# EAGLE schematic BrainA1-5March2015 (EAGLE 7.2.0)
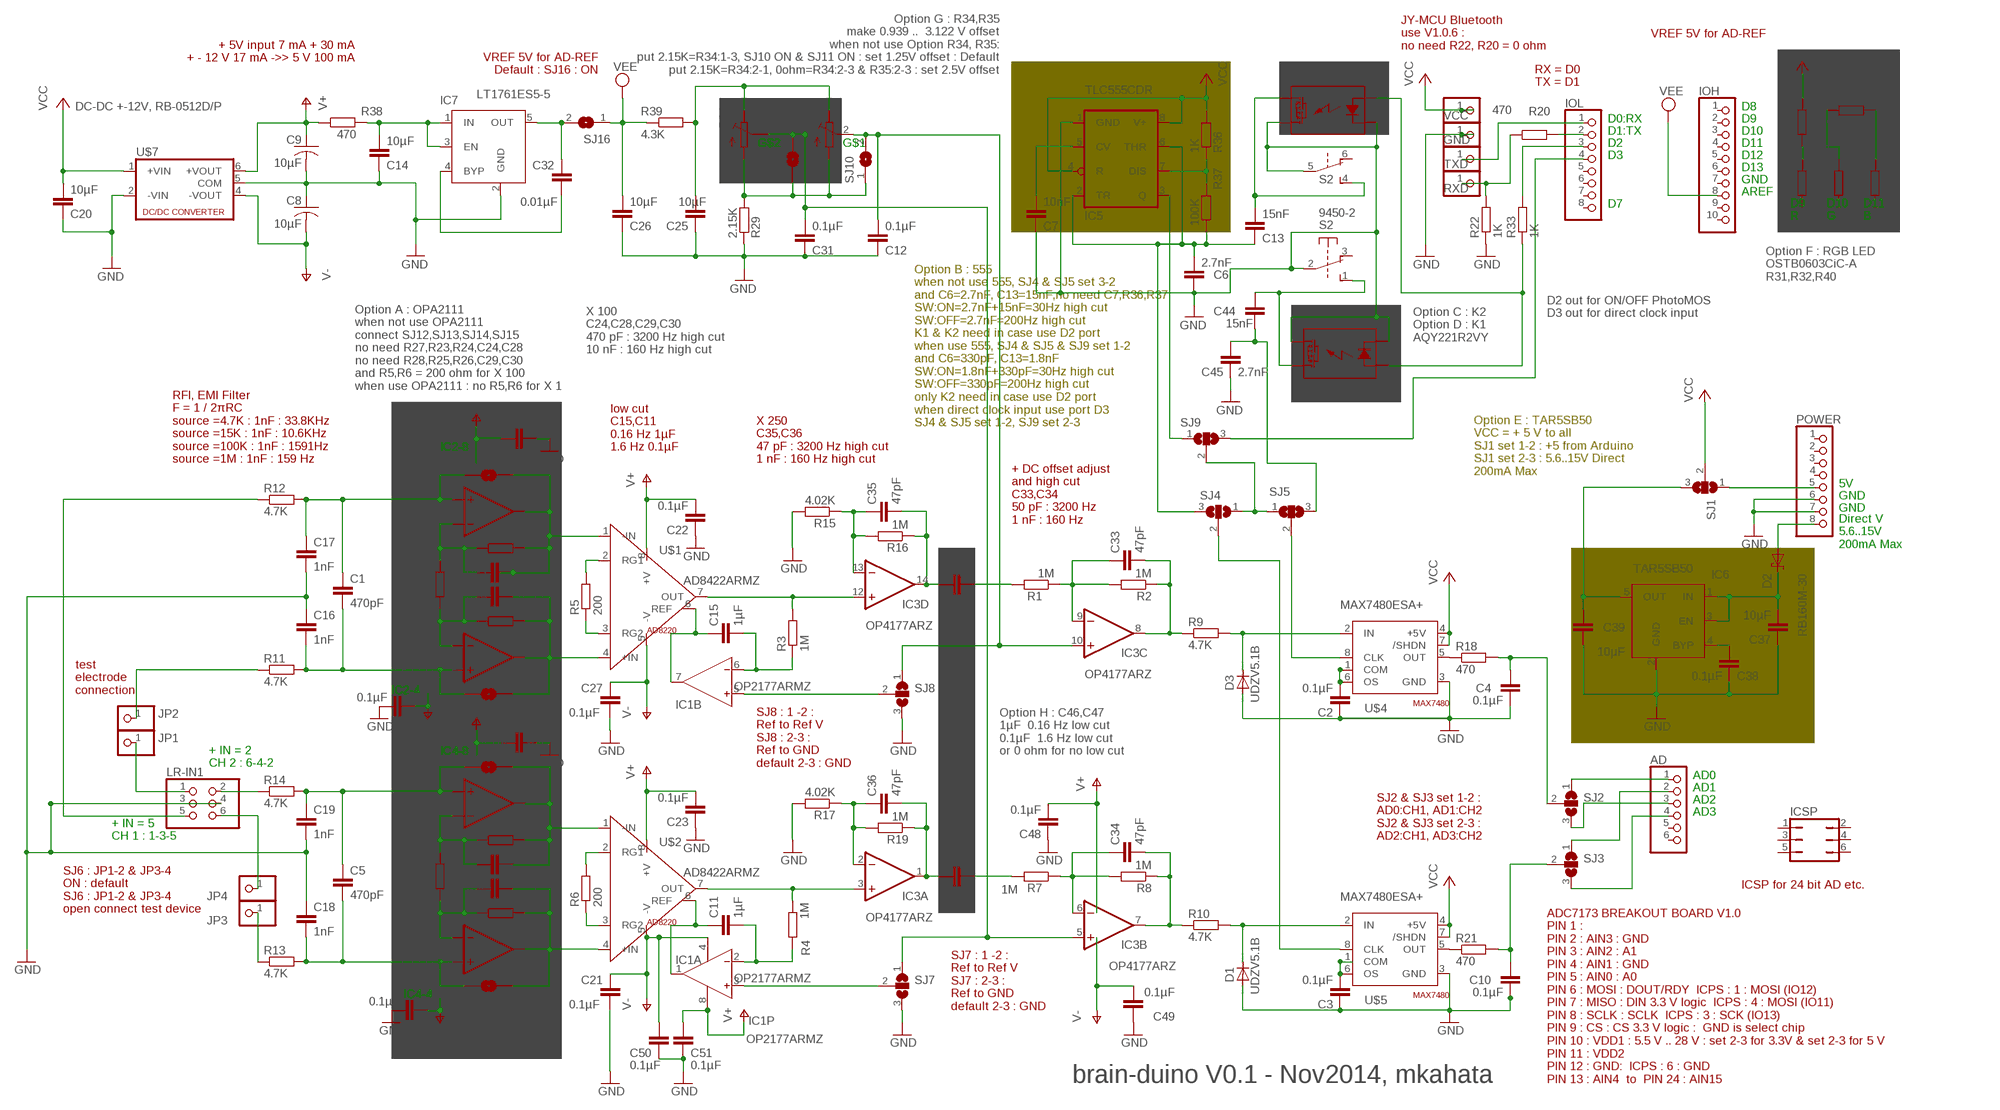
[diagram p0: schematic, sheet 1]

## Parts
AD  PINHD-1X6  [1X06]
C1  470pF  C-EUC0805  [C0805]
C2  0.1µF  C-EUC0805  [C0805]
C3  0.1µF  C-EUC0805  [C0805]
C4  0.1µF  C-EUC0805  [C0805]
C5  470pF  C-EUC0805  [C0805]
C6  2.7nF  C-EUC0805  [C0805]
C7  10nF  C-EUC0805  [C0805]
C8  10µF  C-USC0805  [C0805]
C9  10µF  C-USC0805  [C0805]
C10  0.1µF  C-EUC0805  [C0805]
C11  1µF  C-EUC0805  [C0805]
C12  0.1µF  C-EUC0805  [C0805]
C13  15nF  C-EUC0805  [C0805]
C14  10µF  C-EUC0805  [C0805]
C15  1µF  C-EUC0805  [C0805]
C16  1nF  C-EUC0805  [C0805]
C17  1nF  C-EUC0805  [C0805]
C18  1nF  C-EUC0805  [C0805]
C19  1nF  C-EUC0805  [C0805]
C20  10µF  C-EUC0805  [C0805]
C21  0.1µF  C-EUC0805  [C0805]
C22  0.1µF  C-EUC0805  [C0805]
C23  0.1µF  C-EUC0805  [C0805]
C24  470pF  C-EUC0805  [C0805]
C25  10µF  C-EUC0805  [C0805]
C26  10µF  C-EUC0805  [C0805]
C27  0.1µF  C-EUC0805  [C0805]
C28  470pF  C-EUC0805  [C0805]
C29  470pF  C-EUC0805  [C0805]
C30  470pF  C-EUC0805  [C0805]
C31  0.1µF  C-EUC0805  [C0805]
C32  0.01µF  C-EUC0805  [C0805]
C33  47pF  C-EUC0805  [C0805]
C34  47pF  C-EUC0805  [C0805]
C35  47pF  C-EUC0805  [C0805]
C36  47pF  C-EUC0805  [C0805]
C37  10µF  C-EUC0805  [C0805]
C38  0.1µF  C-EUC0805  [C0805]
C39  10µF  C-EUC0805  [C0805]
C40  0.1µF  C-EUC0805  [C0805]
C41  0.1µF  C-EUC0805  [C0805]
C42  0.1µF  C-EUC0805  [C0805]
C43  0.1µF  C-EUC0805  [C0805]
C44  15nF  C-EUC0805  [C0805]
C45  2.7nF  C-EUC0805  [C0805]
C46  1µF  C-EUC0805  [C0805]
C47  1µF  C-EUC0805  [C0805]
C48  0.1µF  C-EUC0805  [C0805]
C49  0.1µF  C-EUC0805  [C0805]
C50  0.1µF  C-EUC0805  [C0805]
C51  0.1µF  C-EUC0805  [C0805]
D1  UDZV5.1B  DIODE-SOD110-R  [SOD110-R]
D2  RB160M-30  PD3S160  [POWERDI323]
D3  UDZV5.1B  DIODE-SOD110-R  [SOD110-R]
GND  PINHD-1X1  [1X01]
IC1  OP2177ARMZ  AD8656RM  [MSOP08]
IC2  OPA2111KP  OPA2111P  [DIL08]
IC3  OP4177ARZ  TL064D  [SO14]
IC4  OPA2111KP  OPA2111P  [DIL08]
IC5  TLC555CDR  LM555D  [SO08]
IC6  TAR5SB50  MIC5219XX  [SOT23-5]
IC7  LT1761ES5-5  MIC5219XX  [SOT23-5]
ICSP  JP3Q  [JP3Q]
IOH  PINHD-1X10  [1X10]
IOL  PINHD-1X8  [1X08]
JP1  PINHD-1X1  [1X01]
JP2  PINHD-1X1  [1X01]
JP3  PINHD-1X1  [1X01]
JP4  PINHD-1X1  [1X01]
K1  AQY221R2VY  AQY221R2V  [SSOP4]
K2  AQY221R2VY  AQY221R2V  [SSOP4]
LR-IN1  PINHD-2X3/90  [2X03/90]
POWER  PINHD-1X8  [1X08]
R1  1M  R-EU_R0805  [R0805]
R2  1M  R-EU_R0805  [R0805]
R3  1M  R-EU_R0805  [R0805]
R4  1M  R-EU_R0805  [R0805]
R5  200  R-EU_R0805  [R0805]
R6  200  R-EU_R0805  [R0805]
R7  1M  R-EU_R0805  [R0805]
R8  1M  R-EU_R0805  [R0805]
R9  4.7K  R-EU_R0805  [R0805]
R10  4.7K  R-EU_R0805  [R0805]
R11  4.7K  R-EU_R0805  [R0805]
R12  4.7K  R-EU_R0805  [R0805]
R13  4.7K  R-EU_R0805  [R0805]
R14  4.7K  R-EU_R0805  [R0805]
R15  4.02K  R-EU_R0805  [R0805]
R16  1M  R-EU_R0805  [R0805]
R17  4.02K  R-EU_R0805  [R0805]
R18  470  R-EU_R0805  [R0805]
R19  1M  R-EU_R0805  [R0805]
R20  470  R-EU_R0805  [R0805]
R21  470  R-EU_R0805  [R0805]
R22  1K  R-EU_R0805  [R0805]
R23  100K  R-EU_R0805  [R0805]
R24  100K  R-EU_R0805  [R0805]
R25  100K  R-EU_R0805  [R0805]
R26  100K  R-EU_R0805  [R0805]
R27  2K  R-EU_R0805  [R0805]
R28  2K  R-EU_R0805  [R0805]
R29  2.15K  R-EU_R0805  [R0805]
R30  LED  R-EU_R0402  [R0402]
R31  1K  R-EU_R0402  [R0402]
R32  1K  R-EU_R0402  [R0402]
R33  1K  R-EU_R0805  [R0805]
R34  10K  R-TRIMM5X  [RTRIM5X]
R35  10K  R-TRIMM5X  [RTRIM5X]
R36  1K  R-EU_R0805  [R0805]
R37  100K  R-EU_R0805  [R0805]
R38  470  R-EU_R0805  [R0805]
R39  4.3K  R-EU_R0805  [R0805]
R40  1K  R-EU_R0402  [R0402]
R41  LED  R-EU_R0402  [R0402]
RXD  PINHD-1X1  [1X01]
S2  9450-2  [9450-2]
SJ1  SJ2W  [SJ_2]
SJ2  SJ2W  [SJ_2]
SJ3  SJ2W  [SJ_2]
SJ4  SJ2W  [SJ_2]
SJ5  SJ2W  [SJ_2]
SJ7  SJ2W  [SJ_2]
SJ8  SJ2W  [SJ_2]
SJ9  SJ2W  [SJ_2]
SJ10  SJ  [SJ]
SJ11  SJ  [SJ]
SJ12  SJ  [SJ]
SJ13  SJ  [SJ]
SJ14  SJ  [SJ]
SJ15  SJ  [SJ]
SJ16  SJ  [SJ]
TXD  PINHD-1X1  [1X01]
U$1  AD8422ARMZ  AD8220  [AD8220]
U$2  AD8422ARMZ  AD8220  [AD8220]
U$4  MAX7480ESA+  MAX7480  [MAX7480]
U$5  MAX7480ESA+  MAX7480  [MAX7480]
U$7  DC-DC +-12V, RB-0512D/P  RB-0515D  [RB-0515D]
VCC  PINHD-1X1  [1X01]

## Nets
GND: C2.1 C3.1 C4.1 C6.1 C7.1 C8.1 C9.2 C10.1 C12.1 C14.1 C16.1 C17.2 C18.1 C19.2 C20.1 C21.2 C22.1 C23.1 C25.1 C26.1 C27.2 C31.1 C37.1 C38.1 C39.1 C40.1 C41.2 C42.2 C43.2 C45.1 C48.1 C49.1 C50.2 C51.2 D1.A D3.A GND.1 IC5.1(GND) IC6.2(GND) IC7.2(GND) K1.2(K) K1.3(DS2) K2.2(K) K2.3(DS2) LR-IN1.3 LR-IN1.4 POWER.6 POWER.7 R15.2 R17.2 R22.1 R29.1 S2.2(1:P) S2.5(2:P) SJ7.3 SJ8.3 U$4.3(GND) U$5.3(GND) U$7.2(-VIN) U$7.5(COM)
LR-IN: LR-IN1.2 R14.1
N$1: C4.2 R18.2 SJ2.2
N$2: C34.2 IC3.7(B:OUT) R8.1 R10.1
N$3: C47.2 R7.2
N$5: C15.2 IC1.6(B:IN-) R3.1
N$6: C24.1 IC2.2(A:-IN) R23.1 R27.2
N$7: C33.1 IC3.9(C:-IN) R1.1 R2.2
N$8: C34.1 IC3.6(B:-IN) R7.1 R8.2
N$9: D3.C R9.2 U$4.2(IN)
N$10: C10.2 R21.2 SJ3.2
N$12: D1.C R10.2 U$5.2(IN)
N$13: C28.1 IC2.6(B:-IN) R24.1 R27.1
N$14: IC3.12(D:+IN) R3.2 U$1.7(OUT)
N$15: R20.1 R22.2 RXD.1
N$16: C24.2 IC2.1(A:OUT) R23.2 SJ12.1 U$1.1(-IN)
N$17: C15.1 IC1.7(B:OUT) U$1.6(REF)
N$18: C11.1 IC1.1(A:OUT) U$2.6(REF)
N$19: C11.2 IC1.2(A:IN-) R4.1
N$20: C35.1 IC3.13(D:-IN) R15.1 R16.2
N$21: R5.1 U$1.3(RG2)
N$22: C1.2 C16.2 IC2.5(B:+IN) R11.2 SJ13.2
N$24: C28.2 IC2.7(B:OUT) R24.2 SJ13.1 U$1.4(+IN)
N$25: C5.1 C19.1 IC4.3(A:+IN) R14.2 SJ14.2
N$26: C13.2 K2.4(DS1) S2.4(2:S)
N$27: C35.2 C46.1 IC3.14(D:OUT) R16.1
N$28: JP4.1 LR-IN1.6
N$29: C5.2 C18.2 IC4.5(B:+IN) R13.2 SJ15.2
N$30: C36.1 IC3.2(A:-IN) R17.1 R19.2
N$32: C36.2 C47.1 IC3.1(A:OUT) R19.1
N$33: IOL.2 R20.2
N$34: R5.2 U$1.2(RG1)
N$35: IOL.1 TXD.1
N$36: C33.2 IC3.8(C:OUT) R2.1 R9.1
N$37: LR-IN1.5 R12.1
N$38: AD.1 SJ2.1
N$39: C2.2 U$4.1(COM) U$4.6(OS)
N$40: C29.1 IC4.2(A:-IN) R25.1 R28.2
N$41: C3.2 U$5.1(COM) U$5.6(OS)
N$42: C30.1 IC4.6(B:-IN) R26.1 R28.1
N$43: C29.2 IC4.1(A:OUT) R25.2 SJ14.1 U$2.1(-IN)
N$44: R6.2 U$2.2(RG1)
N$45: C30.2 IC4.7(B:OUT) R26.2 SJ15.1 U$2.4(+IN)
N$46: R18.1 U$4.5(OUT)
N$47: AD.2 SJ3.1
N$48: AD.3 SJ2.3
N$49: AD.4 SJ3.3
N$50: IC3.3(A:+IN) R4.2 U$2.7(OUT)
N$51: C38.2 IC6.4(BYP)
N$52: JP2.1 R11.1
N$53: IOL.3 R33.2
N$54: R6.1 U$2.3(RG2)
N$55: C1.1 C17.1 IC2.3(A:+IN) R12.2 SJ12.2
N$56: C14.2 IC7.1(IN) IC7.3(EN) R38.2
N$57: R21.1 U$5.5(OUT)
N$59: C37.2 D2.C IC6.1(IN) IC6.3(EN)
N$65: C31.2 IC3.5(B:+IN) R34.2(S) SJ7.1 SJ11.2
N$74: K1.1(A) K2.1(A) R33.1
N$75: C25.2 R34.3(A) R35.3(A) R39.2
N$77: JP1.1 LR-IN1.1
N$78: IC5.7(DIS) R36.1 R37.2
N$80: C6.2 C13.1 IC5.2(TR) IC5.6(THR) R37.1 SJ4.3
N$81: JP3.1 R13.1
N$82: C32.1 IC7.4(BYP)
N$83: C7.2 IC5.5(CV)
N$84: C39.2 IC6.5(OUT) SJ1.3
N$85: POWER.5 SJ1.1
N$90: R29.2 R34.1(E) R35.1(E) SJ10.1 SJ11.1
N$91: SJ5.2 U$4.8(CLK)
N$92: SJ4.2 U$5.8(CLK)
N$94: IC5.3(Q) SJ9.1
N$95: C44.1 C45.2 SJ5.3
N$97: C44.2 K1.4(DS1) S2.1(1:S)
N$99: R31.2 R41.1
N$100: R30.2 R32.2
N$101: R30.1 R40.2
N$102: C46.2 R1.2
N$103: D2.A POWER.8
N$104: IC1.5(B:IN+) SJ8.2
N$107: C12.2 IC3.10(C:+IN) R35.2(S) SJ8.1 SJ10.2
N$108: IC1.3(A:IN+) SJ7.2
N$109: SJ4.1 SJ5.1 SJ9.2
N$113: IOL.4 SJ9.3
N$119: C32.2 IC7.5(OUT) SJ16.2
V+: C9.1 C22.2 C23.2 C40.2 C42.1 C48.2 C51.1 IC1.8(P:V+) R38.1 U$1.8(+V) U$2.8(+V) U$7.6(+VOUT)
V-: C8.2 C21.1 C27.1 C41.1 C43.1 C49.2 C50.1 IC1.4(P:V-) U$1.5(-V) U$2.5(-V) U$7.4(-VOUT)
VCC: C20.2 IC5.4(R) IC5.8(V+) R36.2 R41.2 SJ1.2 U$4.4(+5V) U$4.7(/SHDN) U$5.4(+5V) U$5.7(/SHDN) U$7.1(+VIN) VCC.1
VEE: C26.2 IOH.8 R39.1 SJ16.1
Unconnected: AD.5 AD.6 ICSP.1 ICSP.2 ICSP.3 ICSP.4 ICSP.5 ICSP.6 IOH.1 IOH.2 IOH.3 IOH.4 IOH.5 IOH.6 IOH.7 IOH.9 IOH.10 IOL.5 IOL.6 IOL.7 IOL.8 POWER.1 POWER.2 POWER.3 POWER.4 R31.1 R32.1 R40.1 S2.3(1:O) S2.6(2:O)

## Notes on the sheet
- VREF 5V for AD-REF
- JY-MCU Bluetooth
  use V1.0.6 :
  no need R22, R20 = 0 ohm
- + 5V input 7 mA + 30 mA
  + - 12 V 17 mA ->> 5 V 100 mA
- VREF 5V for AD-REF
  Default : SJ16 : ON
- Option G : R34,R35
  make 0.939 ..  3.122 V offset
  when not use Option R34, R35:
  put 2.15K=R34:1-3, SJ10 ON & SJ11 ON : set 1.25V offset : Default
  put 2.15K=R34:2-1, 0ohm=R34:2-3 & R35:2-3 : set 2.5V offset
- RX = D0
  TX = D1
- D8
- D0:RX | D9
- D1:TX | D10
- G$2 | G$1 | D2 | D11
- D3 | D12
- D13
- GND
- AREF
- D7
- D9
  R
- D10
  G
- D11
  B
- Option F : RGB LED
  OSTB0603CiC-A
  R31,R32,R40
- D2 out for ON/OFF PhotoMOS
  D3 out for direct clock input
- Option C : K2
  Option D : K1
  AQY221R2VY
- X 100
  C24,C28,C29,C30
  470 pF : 3200 Hz high cut
  10 nF : 160 Hz high cut
- Option A : OPA2111
  when not use OPA2111
  connect SJ12,SJ13,SJ14,SJ15
  no need R27,R23,R24,C24,C28
  no need R28,R25,R26,C29,C30
  and R5,R6 = 200 ohm for X 100
  when use OPA2111 : no R5,R6 for X 1
- Option B : 555
  when not use 555, SJ4 & SJ5 set 3-2
  and C6=2.7nF, C13=15nF,no need C7,R36,R37
  SW:ON=2.7nF+15nF=30Hz high cut
  SW:OFF=2.7nF=200Hz high cut
  K1 & K2 need in case use D2 port
  when use 555, SJ4 & SJ5 & SJ9 set 1-2
  and C6=330pF, C13=1.8nF
  SW:ON=1.8nF+330pF=30Hz high cut
  SW:OFF=330pF=200Hz high cut
  only K2 need in case use D2 port
  when direct clock input use port D3
  SJ4 & SJ5 set 1-2, SJ9 set 2-3
- IC2-8
- low cut
  C15,C11
  0.16 Hz 1µF
  1.6 Hz 0.1µF
- RFI, EMI Filter
  F = 1 / 2πRC
  source =4.7K : 1nF : 33.8KHz
  source =15K : 1nF : 10.6KHz
  source =100K : 1nF : 1591Hz
  source =1M : 1nF : 159 Hz
- X 250
  C35,C36
  47 pF : 3200 Hz high cut
  1 nF : 160 Hz high cut
- Option E : TAR5SB50
  VCC = + 5 V to all
  SJ1 set 1-2 : +5 from Arduino
  SJ1 set 2-3 : 5.6..15V Direct
  200mA Max
- 5V
- GND
- GND
- + DC offset adjust
  and high cut
  C33,C34
  50 pF : 3200 Hz
  1 nF : 160 Hz
- Direct V
  5.6..15V
  200mA Max
- test
  electrode
  connection
- IC2-4
- IC4-8
- Option H : C46,C47
  1µF  0.16 Hz low cut
  0.1µF  1.6 Hz low cut
  or 0 ohm for no low cut
- + IN = 2
  CH 2 : 6-4-2
- SJ8 : 1 -2 : 
  Ref to Ref V
  SJ8 : 2-3 : 
  Ref to GND
  default 2-3 : GND
- AD0
- AD1
- AD2
- AD3
- + IN = 5
  CH 1 : 1-3-5
- SJ2 & SJ3 set 1-2 : 
  AD0:CH1, AD1:CH2
  SJ2 & SJ3 set 2-3 : 
  AD2:CH1, AD3:CH2
- ICSP for 24 bit AD etc.
- SJ6 : JP1-2 & JP3-4
  ON : default
  SJ6 : JP1-2 & JP3-4
  open connect test device
- IC4-4
- SJ7 : 1 -2 : 
  Ref to Ref V
  SJ7 : 2-3 : 
  Ref to GND
  default 2-3 : GND
- brain-duino V0.1 - Nov2014, mkahata
- ADC7173 BREAKOUT BOARD V1.0
  PIN 1 : 
  PIN 2 : AIN3 : GND
  PIN 3 : AIN2 : A1
  PIN 4 : AIN1 : GND
  PIN 5 : AIN0 : A0
  PIN 6 : MOSI : DOUT/RDY  ICPS : 1 : MOSI (IO12)
  PIN 7 : MISO : DIN 3.3 V logic  ICPS : 4 : MOSI (IO11)
  PIN 8 : SCLK : SCLK  ICPS : 3 : SCK (IO13)
  PIN 9 : CS : CS 3.3 V logic :  GND is select chip
  PIN 10 : VDD1 : 5.5 V .. 28 V : set 2-3 for 3.3V & set 2-3 for 5 V
  PIN 11 : VDD2
  PIN 12 : GND:  ICPS : 6 : GND
  PIN 13 : AIN4  to  PIN 24 : AIN15

## Power pins joined to a net without a drawn wire
V+: IC2.8(P:V+) IC3.4(P:V+) IC4.8(P:V+)
V-: IC2.4(P:V-) IC3.11(P:V-) IC4.4(P:V-)

## Library data of the parts
AD = pinhead:PINHD-1X6: PIN HEADER
C1-C7 C10-C51 = rcl:C-EU: CAPACITOR, European symbol
C8 C9 = rcl:C-US: CAPACITOR, American symbol
D1 D3 = diode:DIODE-: DIODE
D2 = diode:PD3S160: 1.0A SURFACE MOUNT SCHOTTKY BARRIER RECTIFIER POWERDI ® 323 Source: http://www.diodes.com/datasheets/ds30899.pdf
GND JP1-JP4 RXD TXD VCC = pinhead:PINHD-1X1: PIN HEADER
IC1 = analog-devices:AD8656: Low Noise, Precision CMOS Amplifier Source: http://www.analog.com/static/imported-files/data_sheets/AD8655_8656.pdf; MPN: AD8656ARMZ; OC_FARNELL: 1117887; OC_NEWARK: 34P3252
IC2 IC4 = linear:OPA2111: OP AMP
IC3 = linear:TL064: OP AMP
IC5 = linear:*555: TIMER
IC6 IC7 = v-reg-micrel:MIC5219XX: VOLTAGE REGULATOR; OC_FARNELL: unknown; OC_NEWARK: unknown
ICSP = jumper:JP3Q: JUMPER
IOH = pinhead:PINHD-1X10: PIN HEADER
IOL POWER = pinhead:PINHD-1X8: PIN HEADER
K1 K2 = relay:AQY221*2V: PHOTOMOS Relay RF (Radio Frequency) NAiS C . R 10 SSOP Type; Source: http://www.mew-europe.com/.. aqy221_2v.pdf; MF: AROMAT/ MATSUSHITA; MPN: AQY221R2V; OC_FARNELL: 1839014; OC_NEWARK: 94C1062
LR-IN1 = pinhead:PINHD-2X3: PIN HEADER
R1-R33 R36-R41 = rcl:R-EU_: RESISTOR, European symbol
R34 R35 = resistor:R-TRIMM: Trimm resistor
S2 = switch-misc:9450-2: MARQUARDT SWITCH
SJ1-SJ5 SJ7-SJ9 = jumper:SJ2W: SMD solder JUMPER
SJ10-SJ16 = jumper:SJ: SMD solder JUMPER
U$1 U$2 = MKH:AD8220: IN-AMP{
U$4 U$5 = MKH:MAX7480: Switched-Capacitor Filter
U$7 = MKH:RB-0515D: 1kVDC / 2kVDC Isolation DC-DC Converter

## Net classes
0 default: clearance 0.205 mm